# Altium schematic sheet mcu.SchDoc
size A4; Organization: Medical Technologies CZ a.s.; SheetNumber: 9; SheetTotal: 10; Version1: N/A; Version2: N/A; Version3: N/A; Change1description: N/A; Change2description: N/A; Change3description: N/A; Change1DrawnBy: N/A; Change2DrawnBy: N/A; Change3DrawnBy: N/A; Change1CheckedBy: N/A; Change2CheckedBy: N/A; Change3CheckedBy: N/A; PreviusVersion_Chng1: N/A; PreviusVersion_Chng2: N/A; PreviusVersion_Chng3: N/A; Variant1description: Standard assembly; Variant2description: N/A; Variant3description: N/A; Variant4description: N/A; PrimaryCard1: XXXxxxXXX; PrimaryCard2: N/A; PrimaryCard3: N/A; PrimaryCard4: N/A; SPICEModelCacheGIGEAIGC: <root> / <DocumentId>GIGEAIGC</DocumentId> / <CacheFrame Number="0"> / <Model Name="grm188r72a104ka35" Kind="CKT"> / <Text>*---------------------------------------------------------------------- / * SPICE Model generated by Murata Manufacturing Co., Ltd. / * Copyright(C) Murata Manufacturing Co., Ltd. / * Description :1608M(0603)/X7R/0.1uF/100V / * Murata P/N :GRM188R72A104KA35 / * Property : C = 0.1[uF] / *---------------------------------------------------------------------- / * Applicable Conditions: / *   Frequency Range = 100Hz-6GHz / *   Temperature = 25 degC / *   DC Bias Voltage = 0V / *   Small Signal Operation / *---------------------------------------------------------------------- / .SUBCKT GRM188R72A104KA35 port1 port2 / C1 port1 11 9.94e-8 / L2 11 12 1.68e-10 / R3 12 13 1.35e-2 / C4 13 14 1.39e-5 / R4 13 14 285 / C5 14 15 2.35e-5 / R5 14 15 28.5 / C6 15 16 1.88e-5 / R6 15 16 7.00 / C7 16 17 1.68e-5 / R7 16 17 9.47e-1 / C8 17 18 1.50e-5 / R8 17 18 1.51e-1 / C9 18 19 1.07e-5 / R9 18 19 2.98e-2 / C10 19 20 1.31e-5 / R10 19 20 3.83e-3 / L11 20 21 1.43e-11 / R11 20 21 8.15e-2 / L12 21 22 1.08e-10 / R12 21 22 7.26e-2 / C13 22 23 4.76e-7 / L13 22 23 2.94e-11 / R13 22 23 3.05e-2 / C14 23 24 1.58e-7 / L14 23 24 2.63e-11 / R14 23 24 2.63e-2 / C15 24 port2 3.33e-12 / L15 24 port2 1.14e-10 / R15 24 port2 22.5 / R100 port1 11 5.00e+9 / .ENDS GRM188R72A104KA35</Text> / </Model> / <Model Name="c1608x5r1e475m080ac_p" Kind="CKT"> / <Text>*---------------------------------------------------------------------- / * SPICE Netlist Generated by TDK Corporation / * Copyright(C) 2015 TDK Corporation. / * All Rights Reserved. / *---------------------------------------------------------------------- / * TDK P/N: C1608X5R1E475M080AC (Multilayer Ceramic Chip Capacitor) / * Property: C=4.7uF / * Size(LxWxT): 1.6x0.8x0.8mm, 0.063x0.031x0.031inches / * Model Type: Precise Model / * Model Generated on June 29, 2015 / *---------------------------------------------------------------------- / * Terms and conditions regarding TDK Simulation Models: / * 1)This simulation model is being provided solely for informational / *   purposes. Please refer to the specifications of the products in / *   terms of detailed characteristics of such products. / * 2)In no event shall TDK Corporation of any of its subsidiaries be / *   liable for any loss or damage arising, directly or indirectly, / *   from any information contained in this simulation model, including, / *   but not limited to loss or damages arising from any inaccuracies, / *   omissions or errors in connection with such information. / * 3)Any and all copyrights on this simulation model are owned by / *   TDK Corporation.  Duplication or redistribution of this simulation / *   model without prior written permission from TDK Corporation / *   is prohibited. / * 4)This simulation model is subject to any modification or change / *   without any prior notice. / * 5)Neither TDK Corporation nor any of its subsidiaries shall make any / *   warranty, express or implied, including but not limited to the / *   correctness, implied warranties of merchantability and fitness for / *   a particular purpose with respect to this simulation models. / * 6)The use of this simulation model shall be deemed to have consented / *   to the terms and conditions hereof. / *---------------------------------------------------------------------- / * External Node Assignments: / * / *  n1 ---| |--- n2 / * / *---------------------------------------------------------------------- / * Applicable Conditions: / *   Temperature = 25 degC / *   DC Bias Voltage = 0 V / *   Small Signal Operation / *---------------------------------------------------------------------- / .SUBCKT C1608X5R1E475M080AC_p n1 n2 / C1 n1 11 4.06623047E-06 / C2 n1 12 1.69290768E-07 / C3 n1 13 1.69290768E-07 / C4 n1 14 1.69290768E-07 / C5 n1 15 1.69290768E-07 / C6 n1 16 1.69290768E-07 / C7 n1 17 1.69290768E-07 / L1 n2 21 4.20000000E-10 / R1 11 21 3.80511499E-03 / R2 11 12 2.03392838E+00 / R3 11 13 1.38719873E+01 / R4 11 14 9.43354501E+01 / R5 11 15 6.39787773E+02 / R6 11 16 4.32816378E+03 / R7 11 17 2.92113653E+04 / R8 n1 11 2.10000000E+07 / .ENDS C1608X5R1E475M080AC_p</Text> / </Model> / <Model Name="mmz2012y152bt000_s" Kind="CKT"> / <Text>*---------------------------------------------------------------------- / * SPICE Netlist Generated by TDK Corporation / * Copyright(C) 2015 TDK Corporation. / * All Rights Reserved. / *---------------------------------------------------------------------- / * TDK P/N: MMZ2012Y152BT000 (Chip Bead) / * Property: |Z|=1500ohm at 100MHz / * Size(LxWxT): 2x1.25x0.85mm, 0.079x0.049x0.033inches / * Model Type: Simple Model / * Model Generated on June 29, 2015 / *---------------------------------------------------------------------- / * Terms and conditions regarding TDK Simulation Models: / * 1)This simulation model is being provided solely for informational / *   purposes. Please refer to the specifications of the products in / *   terms of detailed characteristics of such products. / * 2)In no event shall TDK Corporation of any of its subsidiaries be / *   liable for any loss or damage arising, directly or indirectly, / *   from any information contained in this simulation model, including, / *   but not limited to loss or damages arising from any inaccuracies, / *   omissions or errors in connection with such information. / * 3)Any and all copyrights on this simulation model are owned by / *   TDK Corporation.  Duplication or redistribution of this simulation / *   model without prior written permission from TDK Corporation / *   is prohibited. / * 4)This simulation model is subject to any modification or change / *   without any prior notice. / * 5)Neither TDK Corporation nor any of its subsidiaries shall make any / *   warranty, express or implied, including but not limited to the / *   correctness, implied warranties of merchantability and fitness for / *   a particular purpose with respect to this simulation models. / * 6)The use of this simulation model shall be deemed to have consented / *   to the terms and conditions hereof. / *---------------------------------------------------------------------- / * External Node Assignments: / * / *  n1 ---@@@--- n2 / * / *---------------------------------------------------------------------- / * Applicable Conditions: / *   Temperature = 25 degC / *   DC Bias Current = 0 A / *   Small Signal Operation / *---------------------------------------------------------------------- / .SUBCKT MMZ2012Y152BT000_s n1 n2 / C1 n1 11 6.60000000E-13 / L1 n1 11 2.70000000E-06 / R1 n1 11 1.60000000E+03 / R2 n2 11 2.50000000E-01 / .ENDS MMZ2012Y152BT000_s</Text> / </Model> / <Model Name="mmz1608b301ctah0_s" Kind="CKT"> / <Text>*---------------------------------------------------------------------- / * SPICE Netlist Generated by TDK Corporation / * Copyright(C) 2015 TDK Corporation. / * All Rights Reserved. / *---------------------------------------------------------------------- / * TDK P/N: MMZ1608B301CTAH0 (Chip Bead) / * Property: |Z|=300ohm at 100MHz / * Size(LxWxT): 1.6x0.8x0.6mm, 0.063x0.031x0.024inches / * Model Type: Simple Model / * Model Generated on June 29, 2015 / *---------------------------------------------------------------------- / * Terms and conditions regarding TDK Simulation Models: / * 1)This simulation model is being provided solely for informational / *   purposes. Please refer to the specifications of the products in / *   terms of detailed characteristics of such products. / * 2)In no event shall TDK Corporation of any of its subsidiaries be / *   liable for any loss or damage arising, directly or indirectly, / *   from any information contained in this simulation model, including, / *   but not limited to loss or damages arising from any inaccuracies, / *   omissions or errors in connection with such information. / * 3)Any and all copyrights on this simulation model are owned by / *   TDK Corporation.  Duplication or redistribution of this simulation / *   model without prior written permission from TDK Corporation / *   is prohibited. / * 4)This simulation model is subject to any modification or change / *   without any prior notice. / * 5)Neither TDK Corporation nor any of its subsidiaries shall make any / *   warranty, express or implied, including but not limited to the / *   correctness, implied warranties of merchantability and fitness for / *   a particular purpose with respect to this simulation models. / * 6)The use of this simulation model shall be deemed to have consented / *   to the terms and conditions hereof. / *---------------------------------------------------------------------- / * External Node Assignments: / * / *  n1 ---@@@--- n2 / * / *---------------------------------------------------------------------- / * Applicable Conditions: / *   Temperature = 25 degC / *   DC Bias Current = 0 A / *   Small Signal Operation / *---------------------------------------------------------------------- / .SUBCKT MMZ1608B301CTAH0_s n1 n2 / C1 n1 11 3.00000000E-13 / L1 n1 11 5.30000000E-06 / R1 n1 11 3.00000000E+02 / R2 n2 11 1.50000000E-01 / .ENDS MMZ1608B301CTAH0_s</Text> / </Model> / <Model Name="grt188r61h105ke13" Kind="CKT"> / <Text>*---------------------------------------------------------------------- / * SPICE Model generated by Murata Manufacturing Co., Ltd. / * Copyright(C) Murata Manufacturing Co., Ltd. / * Description :1608M(0603)/X5R/1uF/50V / * Murata P/N :GRT188R61H105KE13 / * Property : C = 1[uF] / *---------------------------------------------------------------------- / * Applicable Conditions: / *   Frequency Range = 100Hz-6GHz / *   Temperature = 25 degC / *   DC Bias Voltage = 5V / *   Small Signal Operation / *---------------------------------------------------------------------- / .SUBCKT GRT188R61H105KE13 port1 port2 / C1 port1 11 7.62e-7 / L2 11 12 1.16e-10 / R3 12 13 7.65e-3 / C4 13 14 3.94e-6 / R4 13 14 1.77e+3 / C5 14 15 1.75e-5 / R5 14 15 15.4 / C6 15 16 1.51e-5 / R6 15 16 1.76 / C7 16 17 1.17e-5 / R7 16 17 2.01e-1 / C8 17 18 8.13e-6 / R8 17 18 2.61e-2 / L9 18 19 2.29e-11 / R9 18 19 8.12e-2 / L10 19 20 1.53e-10 / R10 19 20 4.15e-2 / C11 20 21 2.62e-6 / L11 20 21 3.15e-11 / R11 20 21 1.12e-2 / C12 21 22 7.84e-7 / L12 21 22 5.54e-11 / R12 21 22 1.32e-2 / C13 22 port2 1.55e-12 / L13 22 port2 1.73e-10 / R13 22 port2 64.4 / R100 port1 11 5.00e+7 / .ENDS GRT188R61H105KE13</Text> / </Model> / <Model Name="c1608c0g1h103j080aa_p" Kind="CKT"> / <Text>*---------------------------------------------------------------------- / * SPICE Netlist Generated by TDK Corporation / * Copyright(C) 2015 TDK Corporation. / * All Rights Reserved. / *---------------------------------------------------------------------- / * TDK P/N: C1608C0G1H103J080AA (Multilayer Ceramic Chip Capacitor) / * Property: C=10nF / * Size(LxWxT): 1.6x0.8x0.8mm, 0.063x0.031x0.031inches / * Model Type: Precise Model / * Model Generated on June 29, 2015 / *---------------------------------------------------------------------- / * Terms and conditions regarding TDK Simulation Models: / * 1)This simulation model is being provided solely for informational / *   purposes. Please refer to the specifications of the products in / *   terms of detailed characteristics of such products. / * 2)In no event shall TDK Corporation of any of its subsidiaries be / *   liable for any loss or damage arising, directly or indirectly, / *   from any information contained in this simulation model, including, / *   but not limited to loss or damages arising from any inaccuracies, / *   omissions or errors in connection with such information. / * 3)Any and all copyrights on this simulation model are owned by / *   TDK Corporation.  Duplication or redistribution of this simulation / *   model without prior written permission from TDK Corporation / *   is prohibited. / * 4)This simulation model is subject to any modification or change / *   without any prior notice. / * 5)Neither TDK Corporation nor any of its subsidiaries shall make any / *   warranty, express or implied, including but not limited to the / *   correctness, implied warranties of merchantability and fitness for / *   a particular purpose with respect to this simulation models. / * 6)The use of this simulation model shall be deemed to have consented / *   to the terms and conditions hereof. / *---------------------------------------------------------------------- / * External Node Assignments: / * / *  n1 ---| |--- n2 / * / *---------------------------------------------------------------------- / * Applicable Conditions: / *   Temperature = 25 degC / *   DC Bias Voltage = 0 V / *   Small Signal Operation / *---------------------------------------------------------------------- / .SUBCKT C1608C0G1H103J080AA_p n1 n2 / C1 n1 11 1.00000000E-08 / L1 11 12 3.87447524E-10 / L2 12 13 3.02537762E-11 / L3 13 14 6.87230213E-11 / L4 14 15 1.66916342E-10 / L5 15 16 4.94708926E-10 / R1 n2 12 7.79169483E-02 / R2 n2 13 3.60336449E-02 / R3 n2 14 1.66641994E-02 / R4 n2 15 7.70656268E-03 / R5 n2 16 3.56399409E-03 / R6 n1 11 1.00000000E+10 / .ENDS C1608C0G1H103J080AA_p</Text> / </Model> / </CacheFrame> / </root>; DocumentName: Docname
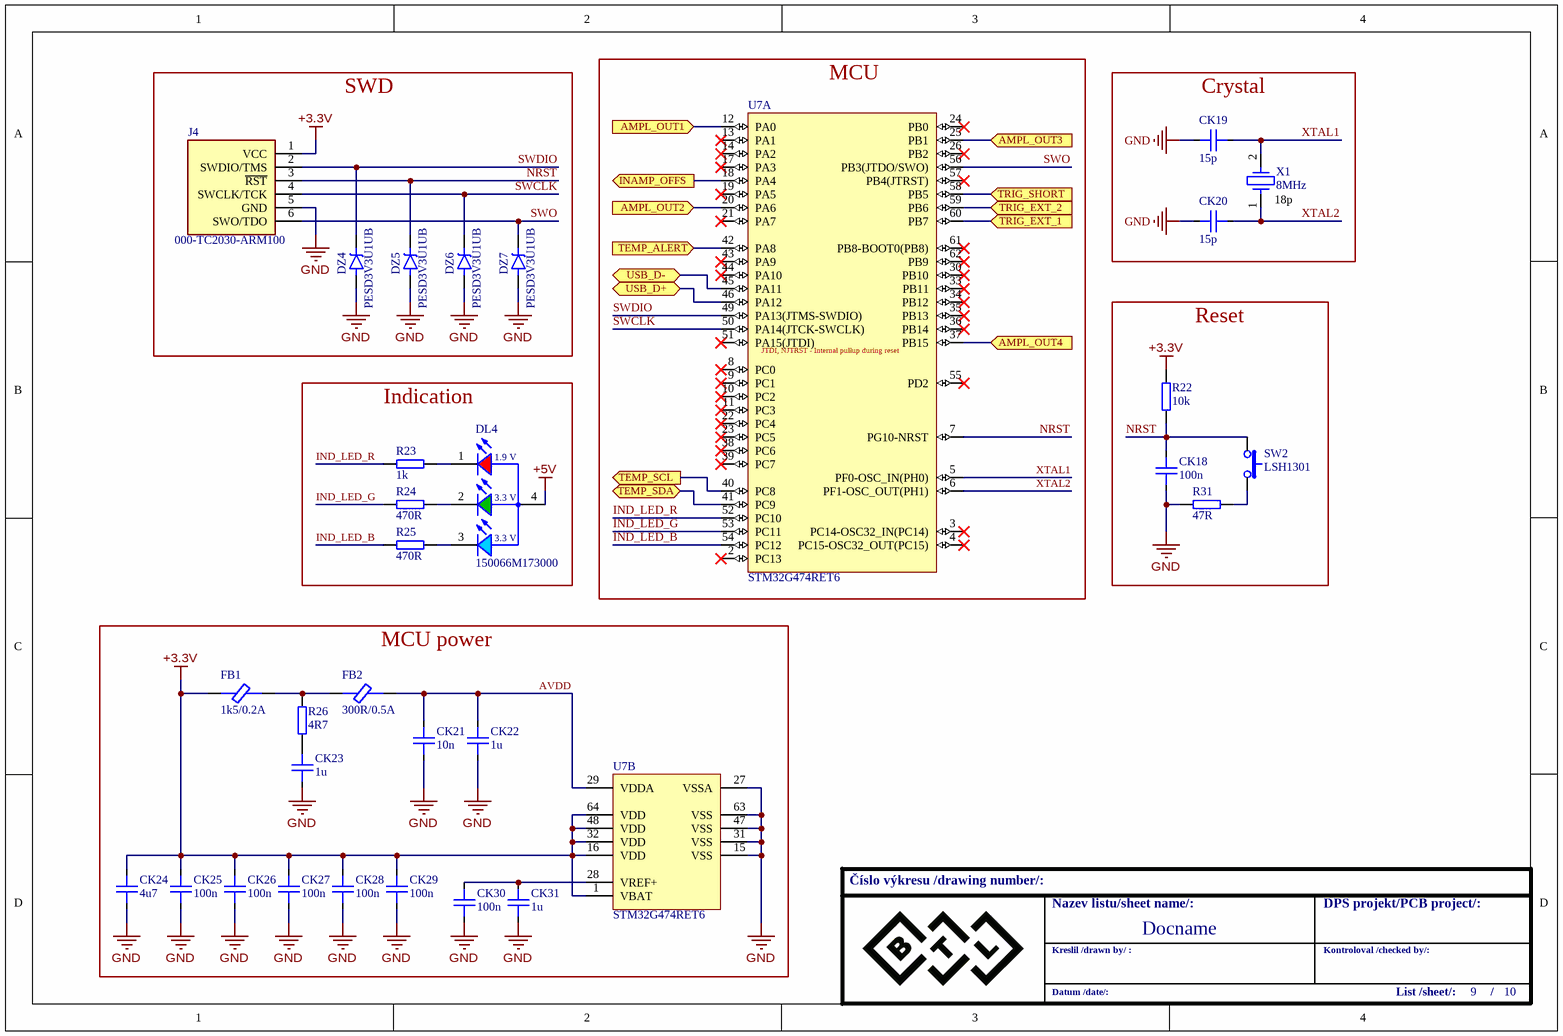
[diagram p0: mcu.SchDoc]

## Parts
CK18  100n  [CAPC1608X09N(SMC0603)]
CK19  15p  [CAPC1608X09N(SMC0603)]
CK20  15p  [CAPC1608X09N(SMC0603)]
CK21  10n  [CAPC1608X09N(SMC0603)]
CK22  1u  [CAPC1608X09N(SMC0603)]
CK23  1u  [CAPC1608X09N(SMC0603)]
CK24  4u7  [CAPC1608X09N(SMC0603)]
CK25  100n  [CAPC1608X09N(SMC0603)]
CK26  100n  [CAPC1608X09N(SMC0603)]
CK27  100n  [CAPC1608X09N(SMC0603)]
CK28  100n  [CAPC1608X09N(SMC0603)]
CK29  100n  [CAPC1608X09N(SMC0603)]
CK30  100n  [CAPC1608X09N(SMC0603)]
CK31  1u  [CAPC1608X09N(SMC0603)]
DL4  150066M173000  [WE_150066M173000]
DZ4  PESD3V3U1UB  [SODFL160X65-2N(SC79)]
DZ5  PESD3V3U1UB  [SODFL160X65-2N(SC79)]
DZ6  PESD3V3U1UB  [SODFL160X65-2N(SC79)]
DZ7  PESD3V3U1UB  [SODFL160X65-2N(SC79)]
FB1  1k5/0.2A  [INDC2012X08N(SML0805)]
FB2  300R/0.5A  [MMZ1608]
J4  000-TC2030-ARM100  [TC2030-MCP-NL]  (no BOM)
R22  10k  [RESC2012X06N(SMR0805)]
R23  1k  [RESC2012X06N(SMR0805)]
R24  470R  [RESC1608X06N(SMR0603)]
R25  470R  [RESC1608X06N(SMR0603)]
R26  4R7  [RESC2012X06N(SMR0805)]
R31  47R  [RESC2012X06N(SMR0805)]
SW2  LSH1301  [LSH_SWITCH]
U7  STM32G474RET6  [TSQFP50P1200X1200X160-64M]  (parts A,B of 2)
X1  8MHz  [TXC_7A]

## Blocks framed on the sheet
SWD: DZ4-DZ7 J4
MCU: U7
Crystal: CK19 CK20 X1
Reset: CK18 R22 R31 SW2
Indication: DL4 R23-R25
MCU power: CK21-CK31 FB1 FB2 R26 U7

## Ports
AMPL_OUT1 (in), AMPL_OUT2 (in), AMPL_OUT3 (in), AMPL_OUT4 (in), INAMP_OFFS (out), TEMP_ALERT (in), TEMP_SCL (out), TEMP_SDA (bidir), TRIG_EXT_1 (in), TRIG_EXT_2 (in), TRIG_SHORT (in), USB_D+ (bidir), USB_D- (bidir)

## Nets
+3.3V: CK24.2 CK25.2 CK26.2 CK27.2 CK28.2 CK29.2 FB1.1(L1A) J4.1(VCC) R22.2 U7.1(VBAT) U7.16(VDD) U7.32(VDD) U7.48(VDD) U7.64(VDD)
+5V: DL4.4(A)
GND: CK18.1 CK19.2 CK20.2 CK21.1 CK22.2 CK23.2 CK24.1 CK25.1 CK26.1 CK27.1 CK28.1 CK29.1 CK30.1 CK31.2 DZ4.2(A) DZ5.2(A) DZ6.2(A) DZ7.2(A) J4.5(GND) R31.2 U7.15(VSS) U7.27(VSSA) U7.31(VSS) U7.47(VSS) U7.63(VSS)
AMPL_OUT1: U7.12(PA0) ; port AMPL_OUT1
AMPL_OUT2: U7.20(PA6) ; port AMPL_OUT2
AMPL_OUT3: U7.25(PB1) ; port AMPL_OUT3
AMPL_OUT4: U7.37(PB15) ; port AMPL_OUT4
AVDD: CK21.2 CK22.1 FB2.2(L1B) U7.29(VDDA)
INAMP_OFFS: U7.18(PA4) ; port INAMP_OFFS
IND_LED_B: R25.1 U7.54(PC12)
IND_LED_G: R24.1 U7.53(PC11)
IND_LED_R: R23.2 U7.52(PC10)
NRST: CK18.2 DZ5.1(C) J4.3(~{RST}) R22.1 SW2.1 U7.7(PG10-NRST)
SWCLK: DZ6.1(C) J4.4(SWCLK/TCK) U7.50(PA14(JTCK-SWCLK))
SWDIO: DZ4.1(C) J4.2(SWDIO/TMS) U7.49(PA13(JTMS-SWDIO))
SWO: DZ7.1(C) J4.6(SWO/TDO) U7.56(PB3(JTDO/SWO))
TEMP_ALERT: U7.42(PA8) ; port TEMP_ALERT
TEMP_SCL: U7.40(PC8) ; port TEMP_SCL
TEMP_SDA: U7.41(PC9) ; port TEMP_SDA
TRIG_EXT_1: U7.60(PB7) ; port TRIG_EXT_1
TRIG_EXT_2: U7.59(PB6) ; port TRIG_EXT_2
TRIG_SHORT: U7.58(PB5) ; port TRIG_SHORT
USB_D+: U7.46(PA12) ; port USB_D+
USB_D-: U7.45(PA11) ; port USB_D-
XTAL1: CK19.1 U7.5(PF0-OSC_IN(PH0)) X1.2
XTAL2: CK20.1 U7.6(PF1-OSC_OUT(PH1)) X1.1
NetCK23_1: CK23.1 R26.1
NetCK30_2: CK30.2 CK31.1 U7.28(VREF+)
NetDL4_1: DL4.1(K) R23.1
NetDL4_2: DL4.2(K) R24.2
NetDL4_3: DL4.3(K) R25.2
NetFB1_2: FB1.2(L1B) FB2.1(L1A) R26.2
NetR31_1: R31.1 SW2.3

Not connected (* = marked no-connect by the designer): U7 2(PC13)* 3(PC14-OSC32_IN(PC14))* 4(PC15-OSC32_OUT(PC15))* 8(PC0)* 9(PC1)* 10(PC2)* 11(PC3)* 13(PA1)* 14(PA2)* 17(PA3)* 19(PA5)* 21(PA7)* 22(PC4)* 23(PC5)* 24(PB0)* 26(PB2)* 30(PB10)* 33(PB11)* 34(PB12)* 35(PB13)* 36(PB14)* 38(PC6)* 39(PC7)* 43(PA9)* 44(PA10)* 51(PA15(JTDI))* 55(PD2)* 57(PB4(JTRST))* 61(PB8-BOOT0(PB8))* 62(PB9)*

## Notes on the sheet
- (near X1) 18p
- Číslo výkresu /drawing number/:
- Nazev listu/sheet name/:
- DPS projekt/PCB project/:
- Kreslil /drawn by/ :
- Kontroloval /checked by/:
- Datum /date/:
- List /sheet/:
- /
- (in symbol EDL+150066M173000X00) 1.9 V; 3.3 V
- (in symbol STM32G474RET6, part A) JTDI, NJTRST - Internal pullup during reset

## Library data of the parts
CK18 CK25-CK30 = ECK+100N100VXX0: C; 100n; 100V; 10%; X7R; ??;; Manufacturer: Murata Electronics: GRM188R72A104KA35D;;Yageo: CC0603KRX7R0BB104; Component_Class: Capacitor; Status_I: Production; Status_II: Active; Tolerance_Pct: 10; Voltage_Rating_V: 100; Capacitance_F: 1E-7; KK: ECK+100N100VXX0; Value: 100n; SMD: 1; ComponentLink2URL: I:\DataSheets\ECK+100N100VXX0_MurataEN100.pdf; ComponentLink2Description: ECK+100N100VXX0_MurataEN100.pdf; ComponentLink3URL: I:\DataSheets\ECK+100N100VXX0_YageoEN100.pdf; ComponentLink3Description: ECK+100N100VXX0_YageoEN100.pdf; ComponentLink4URL: i:\DataSheets\ECK+100N100VXX0_2_MurataEN100.pdf; ComponentLink4Description: ECK+100N100VXX0_2_MurataEN100.pdf; ComponentLink5URL: i:\DataSheets\ECK+100N100VXX0_2_YageoEN100.pdf; ComponentLink5Description: ECK+100N100VXX0_2_YageoEN100.pdf; Dielectric_Type: X7R; ComponentLink1URL: heliosgreen://v1/hegMT/5-MT/Classes(343)/Folders/OpenForm?RecordNumbers=[10556034]; ComponentLink1Description: Helios
CK19 CK20 = ECK+15P25VXX0: C; 15p; 25V; 5%; NP0/C0G; ??;; Manufacturer: Samsung: CL10C150JB81PNC; Component_Class: Capacitor; Status_I: Production; Status_II: Active; Tolerance_Pct: 5; Voltage_Rating_V: 25; Capacitance_F: 1.5E-11; KK: ECK+15P25VXX0; Value: 15p; SMD: 1; ComponentLink2URL: I:\DataSheets\ECK+15P25VXX0_SamsungEN101.pdf; ComponentLink2Description: ECK+15P25VXX0_SamsungEN101.pdf; ComponentLink3URL: i:\DataSheets\ECK+15P25VXX0_2_SamsungEN101.pdf; ComponentLink3Description: ECK+15P25VXX0_2_SamsungEN101.pdf; Dielectric_Type: NP0/C0G; ComponentLink1URL: heliosgreen://v1/hegMT/5-MT/Classes(343)/Folders/OpenForm?RecordNumbers=[10889343]; ComponentLink1Description: Helios
CK21 = ECK+10N50V0603XX0: C; 10n; 50V; 5%; NP0/C0G; ??;; Manufacturer: TDK: C1608C0G1H103J080AA; Component_Class: Capacitor; Status_I: Production; Status_II: Do not order. Upon confirmation.; Tolerance_Pct: 5; Voltage_Rating_V: 50; Capacitance_F: 1E-8; KK: ECK+10N50V0603XX0; Value: 10n; SMD: 1; ComponentLink2URL: I:\DataSheets\ECK+10N50V0603XX0_TdkEN100.pdf; ComponentLink2Description: ECK+10N50V0603XX0_TdkEN100.pdf; Dielectric_Type: NP0/C0G; ComponentLink1URL: heliosgreen://v1/hegMT/5-MT/Classes(343)/Folders/OpenForm?RecordNumbers=[12587254]; ComponentLink1Description: Helios
CK22 CK23 CK31 = ECK+1U50VXX0: C; 1u; 50V; 10%; X5R; ??;; Manufacturer: TDK: C1608X5R1H105K080AB;;TDK: CGA3E3X5R1H105K080AB;;Murata: GRT188R61H105KE13D;;AVX: 06035D105KAT2A; Note: X5R: 0.52uF @ 10V, 0.2uF @ 25V (Murata); Component_Class: Capacitor; Status_I: Production; Status_II: Active; Tolerance_Pct: 10; Voltage_Rating_V: 50; Capacitance_F: 1E-6; KK: ECK+1U50VXX0; Value: 1u; SMD: 1; ComponentLink2URL: i:\DataSheets\ECK+1U50VXX0_TDKEN100.pdf; ComponentLink2Description: ECK+1U50VXX0_TDKEN100.pdf; ComponentLink3URL: I:\DataSheets\ECK+1U50VXX0_AVX_EN100.pdf; ComponentLink3Description: ECK+1U50VXX0_AVX_EN100.pdf; ComponentLink4URL: I:\DataSheets\ECK+1U50VXX0_MurataEN100.pdf; ComponentLink4Description: ECK+1U50VXX0_MurataEN100.pdf; ComponentLink5URL: I:\DataSheets\ECK+1U50VXX0_TDK_EN101.pdf; ComponentLink5Description: ECK+1U50VXX0_TDK_EN101.pdf; ComponentLink6URL: i:\DataSheets\ECK+1U50VXX0_2_AVX_EN100.pdf; ComponentLink6Description: ECK+1U50VXX0_2_AVX_EN100.pdf; Dielectric_Type: X5R; ComponentLink1URL: heliosgreen://v1/hegMT/5-MT/Classes(343)/Folders/OpenForm?RecordNumbers=[9390428]; ComponentLink1Description: Helios
CK24 = ECK+4U725VXX0: C; 4u7; 25V; 20%; X5R; ??;; Manufacturer: TDK Corporation: C1608X5R1E475M080AC; Note: X5R, 1.2uF @ 10V, 2.6uF @ 5V, 3.6uF @ 3.3V; Component_Class: Capacitor; Status_I: Production; Status_II: Active; Tolerance_Pct: 20; Voltage_Rating_V: 25; Capacitance_F: 4.7E-6; KK: ECK+4U725VXX0; Value: 4u7; SMD: 1; ComponentLink2URL: I:\DataSheets\ECK+4U725VXX0_TDK CorporationEN100.pdf; ComponentLink2Description: ECK+4U725VXX0_TDK CorporationEN100.pdf; Dielectric_Type: X5R; ComponentLink1URL: heliosgreen://v1/hegMT/5-MT/Classes(343)/Folders/OpenForm?RecordNumbers=[8599163]; ComponentLink1Description: Helios
DL4 = EDL+150066M173000X00: Ind; Light; Red/Green/Blue;; Manufacturer: Würth: 150066M173000; Component_Class: Indicator; Status_I: Production; Status_II: Active; KK: EDL+150066M173000X00; Value: 150066M173000; SMD: 1; ComponentLink2URL: i:\DataSheets\EDL+150066M173000_WurthEN100.pdf; ComponentLink2Description: EDL+150066M173000_WurthEN100.pdf; Indicator_Type: Light; Indicator_Output: Red/Green/Blue; ComponentLink1URL: heliosgreen://v1/hegMT/5-MT/Classes(343)/Folders/OpenForm?RecordNumbers=[12710357]; ComponentLink1Description: Helios
DZ4-DZ7 = ED+PESD3V3U1UBXX0: CP; Voltage [V] - Unidirectional; 4.5; R:Yes; 1x;; Manufacturer: Nexperia: PESD3V3U1UB,115;;NXP: PESD3V3U1UB,115; Component_Class: Circuit Protection; Status_I: Production; Status_II: Active; Multiplicity: 1; Resettable: Yes; Trip_Threshold: 4.5; KK: ED+PESD3V3U1UBXX0; Value: PESD3V3U1UB; SMD: 1; ComponentLink2URL: I:\DataSheets\ED+PESD3V3U1UBXX0_NexperiaEN100.pdf; ComponentLink2Description: ED+PESD3V3U1UBXX0_NexperiaEN100.pdf; Physical_Quantity: Voltage [V] - Unidirectional; ComponentLink1URL: heliosgreen://v1/hegMT/5-MT/Classes(343)/Folders/OpenForm?RecordNumbers=[10662650]; ComponentLink1Description: Helios
FB1 = EL+JCB09152XX0: Flt; Chip Bead; 0.7Ohm; 0.2A; ??V; 1x;; Manufacturer: COILMASTER: MB2012-152-LF;;JANTEK: JCB201209-152;;King Core: FBM-10-201209-102;;YAGEO: SBK2012T-152Y-S;;TDK: MMZ2012Y152B; Component_Class: Filter; Status_I: Production; Status_II: Active; Multiplicity: 1; Resistance_Ohm: 0.7; Current_Rating_A: 0.2; Mounting_Style: PCB; KK: EL+JCB09152XX0; Value: 1k5/0.2A; SMD: 1; ComponentLink2URL: i:\DataSheets\EL+JCB09152XX0_Coilmaster.pdf; ComponentLink2Description: EL+JCB09152XX0_Coilmaster.pdf; Filter_Type: Chip Bead; ComponentLink1URL: heliosgreen://v1/hegMT/5-MT/Classes(343)/Folders/OpenForm?RecordNumbers=[381245]; ComponentLink1Description: Helios
FB2 = EL+MMZ1608B301XX0: Flt; Chip Bead; 0.25Ohm; 0.5A; ??V; 1x;; Manufacturer: TDK: MMZ1608B301CTAH0;;TDK: MMZ1608B301CT; Component_Class: Filter; Status_I: Production; Status_II: Active; Multiplicity: 1; Resistance_Ohm: 0.25; Current_Rating_A: 0.5; Mounting_Style: PCB; KK: EL+MMZ1608B301XX0; Value: 300R/0.5A; SMD: 1; ComponentLink2URL: I:\DataSheets\EL+MMZ1608B301XX0_TDK EN100.pdf; ComponentLink2Description: EL+MMZ1608B301XX0_TDK EN100.pdf; Filter_Type: Chip Bead; ComponentLink1URL: heliosgreen://v1/hegMT/5-MT/Classes(343)/Folders/OpenForm?RecordNumbers=[10556082]; ComponentLink1Description: Helios
J4 = 000-TC2030-ARM100: De; Programming connector;; Note: Programming connector ARM - STM32; Component_Class: Design Entity; Status_I: Development; Status_II: Testing; KK: 000-TC2030-ARM100; Value: 000-TC2030-ARM100; SMD: 0; Entity_Type: Programming connector; ComponentLink1URL: heliosgreen://v1/hegMT/5-MT/Classes(343)/Folders/OpenForm?RecordNumbers=[12745287]; ComponentLink1Description: Helios
R22 = ER+10K0.1WXXF: R; 10k; 0.125W; 1%; 150V; Thick Film; ±100ppm/K; 1x;; Manufacturer: VISHAY: CRCW0805 10KOHM TK100 1%;;AVX: CR21-1002F-T;;BC Components: MCU0805-50 1% P5 10k;;YAGEO: RC0805FR-0710KL;;PANASONIC: ERJ 6EN F 1002 V;;HaS Lanskroun: CMF0805 10k 1% 100ppm/K;;ASJ: CR21-1002-FL; Component_Class: Resistor; Status_I: Production; Status_II: Active; Tolerance_Pct: 1; Voltage_Rating_V: 150; Resistance_Ohm: 10000; Power_Rating_W: 0.125; Temperature_Coefficient_PPMpK: ±100; KK: ER+10K0.1WXXF; Value: 10k; SMD: 1; ComponentLink2URL: i:\DataSheets\ER+0.1WXXF_Yageo.pdf; ComponentLink2Description: ER+0.1WXXF_Yageo.pdf; Multiplicity: 1; Resistor_Type: Thick Film; ComponentLink1URL: heliosgreen://v1/hegMT/5-MT/Classes(343)/Folders/OpenForm?RecordNumbers=[381481]; ComponentLink1Description: Helios
R23 = ER+1K0.1WXXF: R; 1k; 0.125W; 1%; 150V; Thick Film; ±100ppm/K; 1x;; Manufacturer: VISHAY: CRCW0805 1001 100 1% RT1 BC;;AVX: CR21-1001F-T;;BC Components: MCU0805-50 1% P5 1k0;;YAGEO: RC0805FR-071KL;;PANASONIC: ERJ 6EN F 1001 V;;HaS Lanskroun: CMF0805 1k0 1% 100ppm/K;;ASJ: CR21-1001-FL; Component_Class: Resistor; Status_I: Production; Status_II: Active; Tolerance_Pct: 1; Voltage_Rating_V: 150; Resistance_Ohm: 1000; Power_Rating_W: 0.125; Temperature_Coefficient_PPMpK: ±100; KK: ER+1K0.1WXXF; Value: 1k; SMD: 1; ComponentLink2URL: i:\DataSheets\ER+0.1WXXF_Yageo.pdf; ComponentLink2Description: ER+0.1WXXF_Yageo.pdf; Multiplicity: 1; Resistor_Type: Thick Film; ComponentLink1URL: heliosgreen://v1/hegMT/5-MT/Classes(343)/Folders/OpenForm?RecordNumbers=[381513]; ComponentLink1Description: Helios
R24 R25 = ER+470R0.1WXX2: R; 470R; 0.1W; 1%; 75V; Thick Film; ±100ppm/K; 1x;; Manufacturer: Yageo: RC0603FR-07470RL;;Panasonic: ERJ3EKF4700V; Component_Class: Resistor; Status_I: Production; Status_II: Active; Tolerance_Pct: 1; Voltage_Rating_V: 75; Resistance_Ohm: 470; Power_Rating_W: 0.1; Temperature_Coefficient_PPMpK: ±100; KK: ER+470R0.1WXX2; Value: 470R; SMD: 1; ComponentLink2URL: I:\DataSheets\ER+470R0.1WXX2_YageoEN100.pdf; ComponentLink2Description: ER+470R0.1WXX2_YageoEN100.pdf; ComponentLink3URL: I:\datasheets\ER+470R0.1WXX2_PanasonicEN100.pdf; ComponentLink3Description: ER+470R0.1WXX2_PanasonicEN100.pdf; Multiplicity: 1; Resistor_Type: Thick Film; ComponentLink1URL: heliosgreen://v1/hegMT/5-MT/Classes(343)/Folders/OpenForm?RecordNumbers=[11656564]; ComponentLink1Description: Helios
R26 = ER+4R70.1WXXJ: R; 4R7; 0.125W; 5%; 150V; Thick Film; ±200ppm/K; 1x;; Manufacturer: YAGEO: RC0805FR-074R7L;;BC Components: MCU0805-50 1% P5 4R7; Component_Class: Resistor; Status_I: Production; Status_II: Active; Tolerance_Pct: 5; Multiplicity: 1; Voltage_Rating_V: 150; Resistance_Ohm: 4.7; Power_Rating_W: 0.125; Temperature_Coefficient_PPMpK: ±200; KK: ER+4R70.1WXXJ; Value: 4R7; SMD: 1; ComponentLink2URL: i:\DataSheets\ER+0.1WXXF_Yageo.pdf; ComponentLink2Description: ER+0.1WXXF_Yageo.pdf; ComponentLink3URL: i:\DataSheets\ER+1WXXJ_Yageo.pdf; ComponentLink3Description: ER+1WXXJ_Yageo.pdf; Resistor_Type: Thick Film; ComponentLink1URL: heliosgreen://v1/hegMT/5-MT/Classes(343)/Folders/OpenForm?RecordNumbers=[381599]; ComponentLink1Description: Helios
R31 = ER+47R0.1WXXF: R; 47R; 0.125W; 1%; 150V; Thick Film; ±100ppm/K; 1x;; KK: ER+47R0.1WXXF
SW2 = ESW+LSH1301XX0: MSw; SPST; PCB; 1x; DC:12V; DC:0.05A; AC:??V; AC:??A; CV:??V; Push-button;; Manufacturer: DIPTRONICS: DTSM-62N-V-T/R; Component_Class: Mechanical Switch; Status_I: Production; Status_II: Active; Multiplicity: 1; Current_Rating_DC_A: 0.05; Voltage_Rating_DC_V: 12; KK: ESW+LSH1301XX0; Value: LSH1301; SMD: 1; ComponentLink2URL: i:\DataSheets\ESW+LSH1301H7XX0_Schurter.pdf; ComponentLink2Description: ESW+LSH1301H7XX0_Schurter.pdf; ComponentLink3URL: i:\DataSheets\SMD_parts_pictures\ESW+LSH1301XX0-a.jpg; ComponentLink3Description: ESW+LSH1301XX0-a.jpg; ComponentLink4URL: i:\DataSheets\SMD_parts_pictures\ESW+LSH1301XX0-b.jpg; ComponentLink4Description: ESW+LSH1301XX0-b.jpg; ComponentLink5URL: i:\DataSheets\ESW+LSH1301XX0_DiptronicsEN100.pdf; ComponentLink5Description: ESW+LSH1301XX0_DiptronicsEN100; Mounting_Style: PCB; Switch_Configuration: SPST; Mechanical_Switch_Type: Push-button; ComponentLink1URL: heliosgreen://v1/hegMT/5-MT/Classes(343)/Folders/OpenForm?RecordNumbers=[382002]; ComponentLink1Description: Helios
U7 = STM32G474RET6: ARM Cortex-M4 32-bit MCU+FPU, 213 DMIPS, 512 kB Flash, 128 kB Internal RAM, 52 I/Os, 64-pin LQFP, -40 to 85 degC, Tray; Value: STM32G474RET6; ComponentLink1Description: Datasheet; ComponentLink1URL: https://www.st.com/resource/en/datasheet/stm32g474cb.pdf
X1 = EX+8.000MXX2: Oth; Crystal;; Manufacturer: Abracon: ABM3-8.000MHZ-D2Y-T; Note: 8MHz, freq tol. 20ppm, freq stab. 30ppm, 18pF; Component_Class: Other; Status_I: Production; Status_II: Active; KK: EX+8.000MXX2; Value: 8MHz; SMD: 1; ComponentLink2URL: I:\DataSheets\EX+8.000MXX2_AbraconEN100.pdf; ComponentLink2Description: EX+8.000MXX2_AbraconEN100.pdf; Others_Type: Crystal; ComponentLink1URL: heliosgreen://v1/hegMT/5-MT/Classes(343)/Folders/OpenForm?RecordNumbers=[17102653]; ComponentLink1Description: Helios